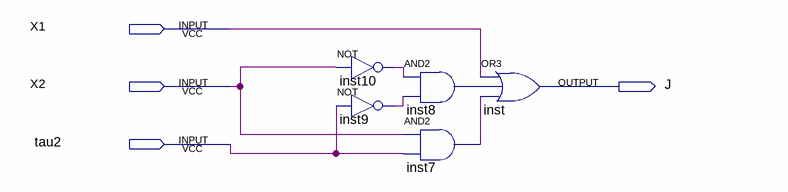
[diagram p0: schematic sheet]
// Quartus schematic Block4.bdf as structural Verilog: 5 symbols, 4 pins
module Block4 (
  input  X1,
  input  X2,
  input  tau2,
  output J
);

  wire inst7_out, inst8_out, inst9_out, inst10_out;

  not inst10 (inst10_out, X2);
  not inst9 (inst9_out, tau2);
  and inst8 (inst8_out, inst10_out, inst9_out);
  and inst7 (inst7_out, X2, tau2);
  or inst (J, X1, inst8_out, inst7_out);
endmodule
